# EAGLE board h11-5 (EAGLE 6.6.0)
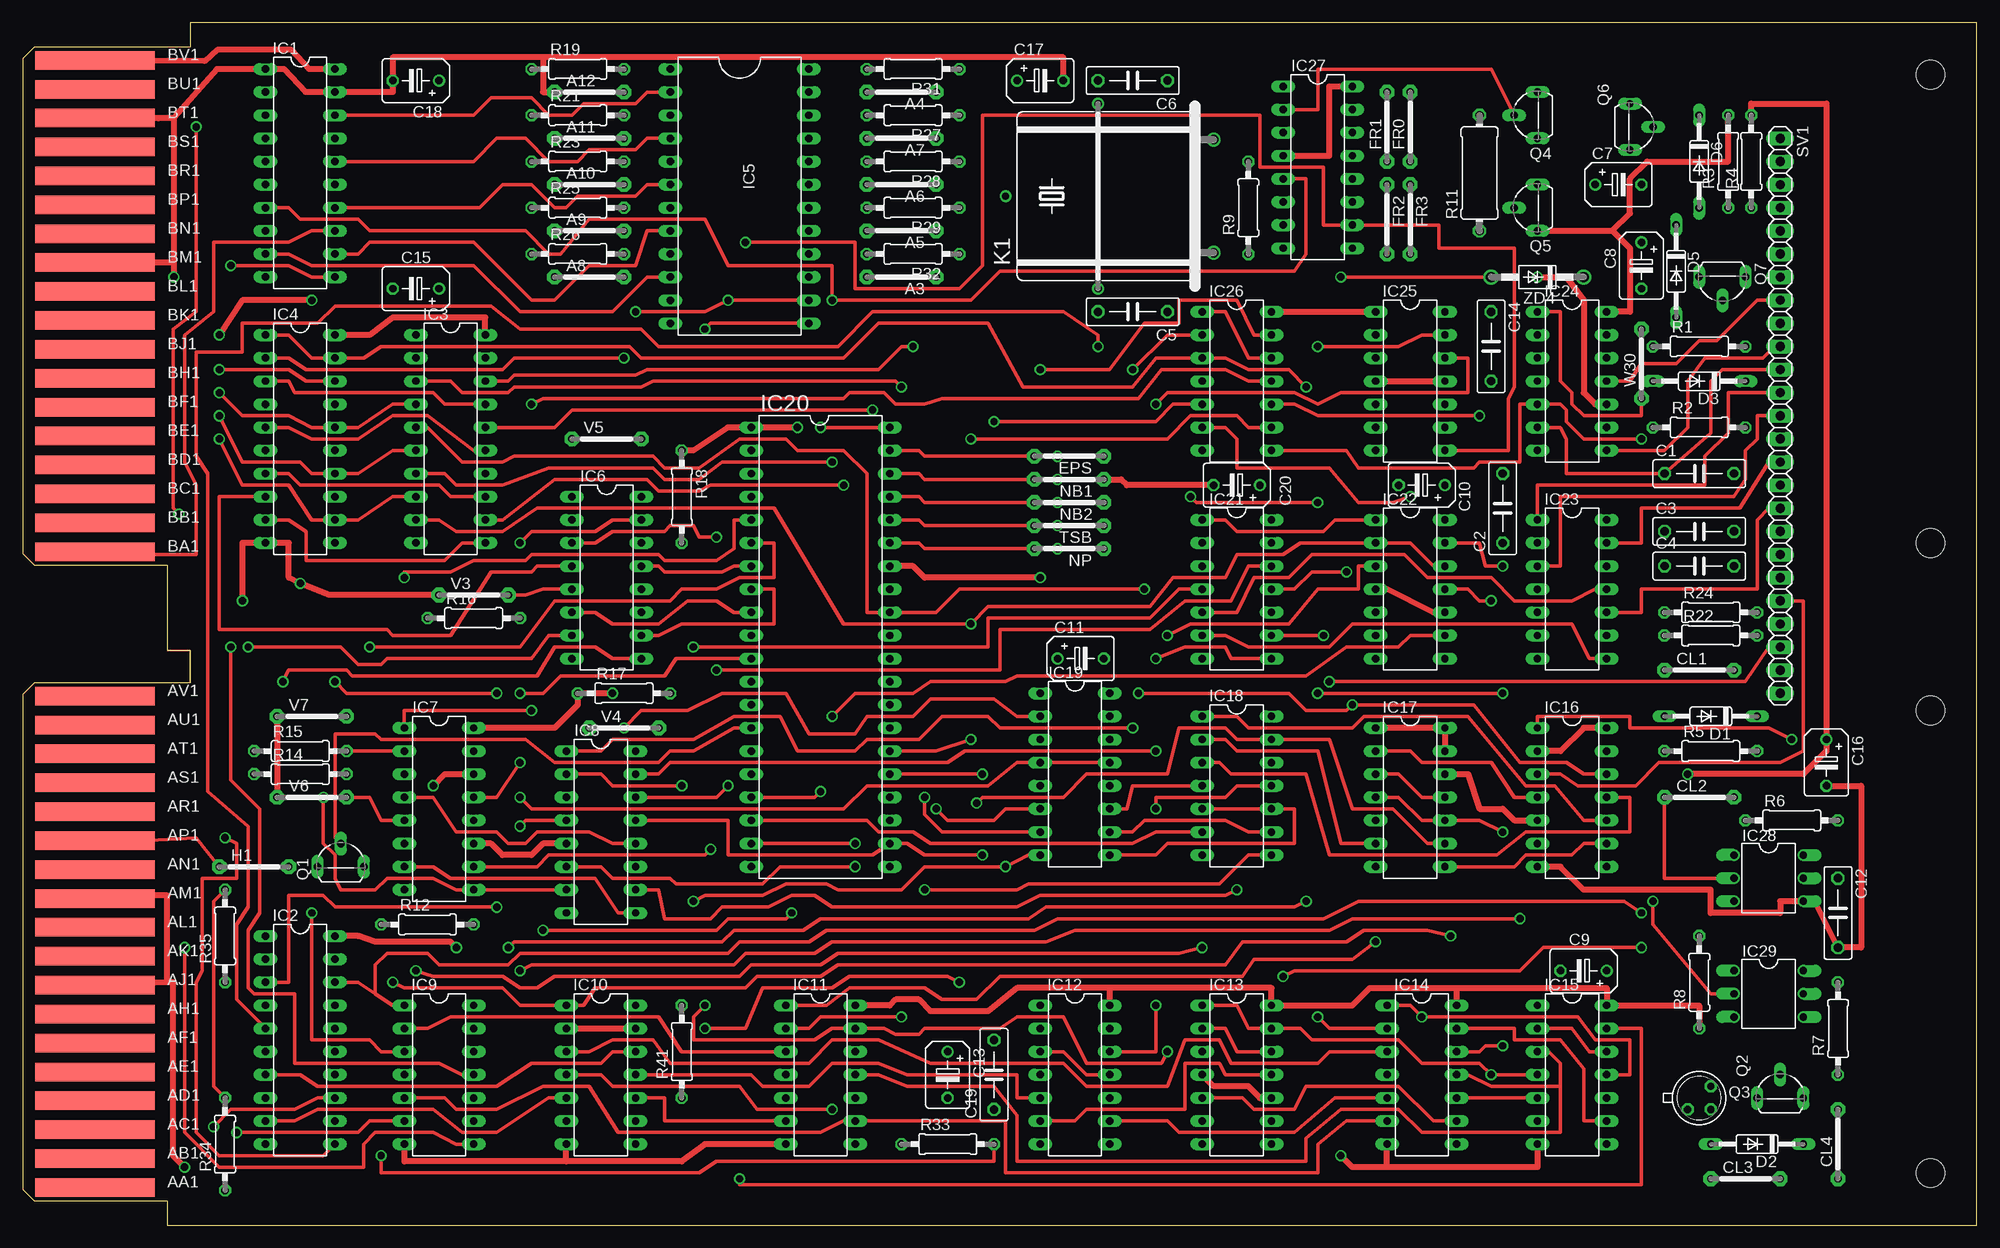
[diagram p2: board, top side]
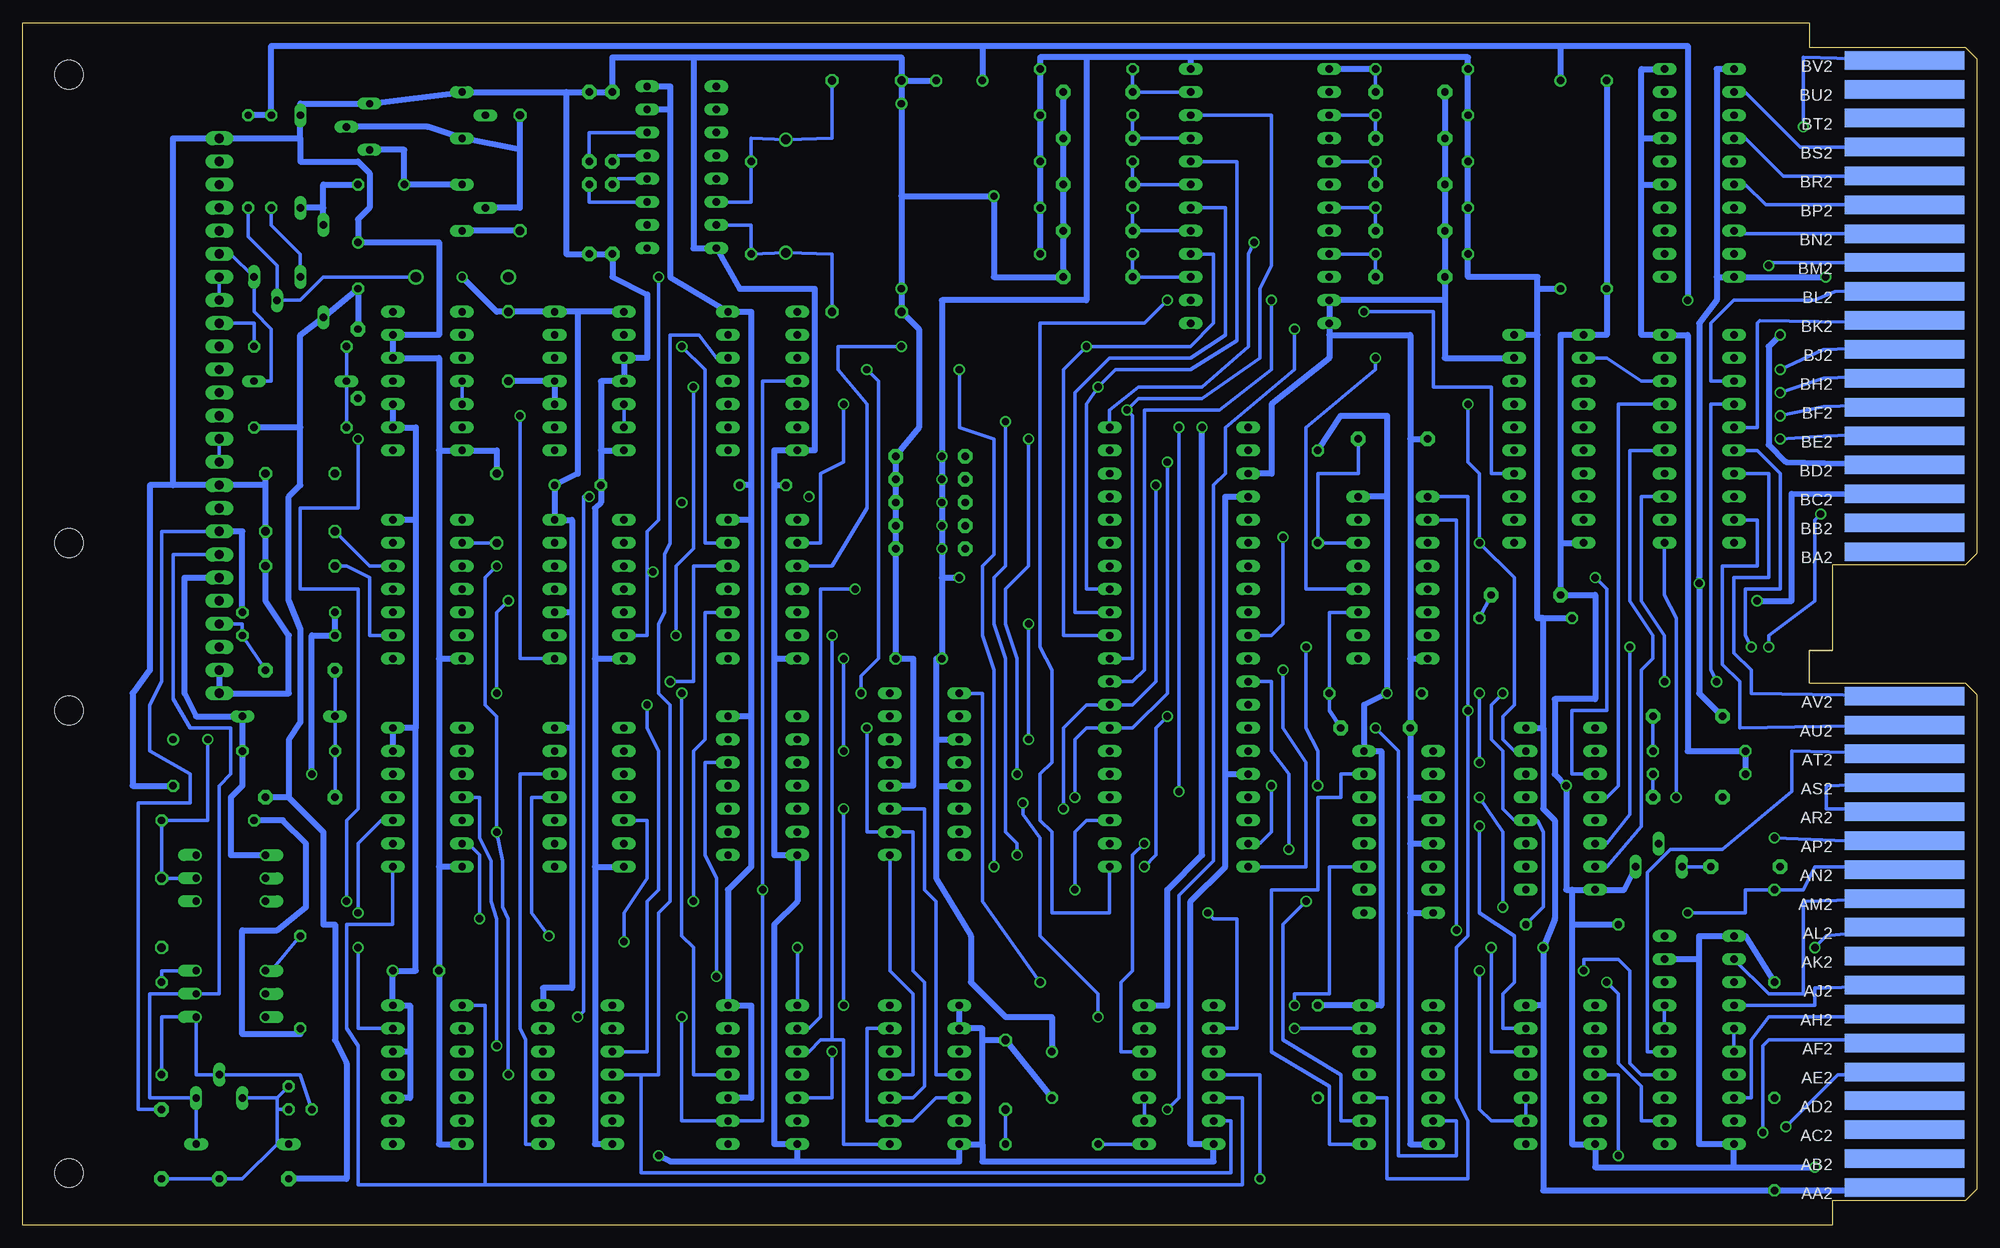
[diagram p3: board, bottom side, seen from below]

Size 214.63 x 132.08 mm. Coordinates in mm from the lower left corner, seen from the top.
Copper layers (1+16): Top 0.035mm / dielectric 1.5mm / Bottom 0.035mm
Design rules "16mils": minimum track width 16mil, minimum drill 32mil, track to track 15mil, track to pad 10mil, pad to pad 10mil, via to via 10mil, smd to smd 10mil, copper to edge 13mil, drill to drill 10mil, minimum pad ring 10mil, minimum via ring 8mil, stop-mask expansion 0mil, vias tented up to drill 0mil, thermal gap 10mil
Net classes: 1 Supply: width 0.635 mm

## Footprints (pad centres in the part's own frame; a part is rotated, then mirrored left to right if it is on the bottom)
07 = drill 0.813 pad 1.6 octagon: 1 -3.81,0; 2 3.81,0
C075-032X103 = drill 0.914 octagon: 1 -3.81,0; 2 3.81,0
B45181B = drill 0.813: + -2.54,0 | drill 0.813 octagon: - 2.54,0
DO35-10 = drill 0.813 long: A 5.08,0; C -5.08,0
DOUBLE-LONG = hole 3.175: 209.55,56.515; 209.55,5.715; 209.55,74.93; 209.55,126.365
EDGE-CON4 = smd 13.106 x 2.032: AA1 7.938,4.128; AB1 7.938,7.303; AC1 7.938,10.477; AD1 7.938,13.652; AE1 7.938,16.828; AF1 7.938,20.003; AH1 7.938,23.177; AJ1 7.938,26.352; AK1 7.938,29.527; AL1 7.938,32.703; AM1 7.938,35.877; AN1 7.938,39.053; AP1 7.938,42.227; AR1 7.938,45.403; AS1 7.938,48.578; AT1 7.938,51.752; AU1 7.938,54.928; AV1 7.938,58.102; BA1 7.938,73.978; BB1 7.938,77.153; BC1 7.938,80.328; BD1 7.938,83.502; BE1 7.938,86.677; BF1 7.938,89.853; BH1 7.938,93.028; BJ1 7.938,96.203; BK1 7.938,99.377; BL1 7.938,102.552; BM1 7.938,105.728; BN1 7.938,108.903; BP1 7.938,112.078; BR1 7.938,115.252; BS1 7.938,118.427; BT1 7.938,121.603; BU1 7.938,124.778; BV1 7.938,127.953 | smd 13.106 x 2.032 bottom: AA2 7.938,4.128; AB2 7.938,7.303; AC2 7.938,10.477; AD2 7.938,13.652; AE2 7.938,16.828; AF2 7.938,20.003; AH2 7.938,23.177; AJ2 7.938,26.352; AK2 7.938,29.527; AL2 7.938,32.703; AM2 7.938,35.877; AN2 7.938,39.053; AP2 7.938,42.227; AR2 7.938,45.403; AS2 7.938,48.578; AT2 7.938,51.752; AU2 7.938,54.928; AV2 7.938,58.102; BA2 7.938,73.978; BB2 7.938,77.153; BC2 7.938,80.328; BD2 7.938,83.502; BE2 7.938,86.677; BF2 7.938,89.853; BH2 7.938,93.028; BJ2 7.938,96.203; BK2 7.938,99.377; BL2 7.938,102.552; BM2 7.938,105.728; BN2 7.938,108.903; BP2 7.938,112.078; BR2 7.938,115.252; BS2 7.938,118.427; BT2 7.938,121.603; BU2 7.938,124.778; BV2 7.938,127.953
DIL20 = drill 0.813 long: 1 -11.43,-3.81; 2 -8.89,-3.81; 3 -6.35,-3.81; 4 -3.81,-3.81; 5 -1.27,-3.81; 6 1.27,-3.81; 7 3.81,-3.81; 8 6.35,-3.81; 9 8.89,-3.81; 10 11.43,-3.81; 11 11.43,3.81; 12 8.89,3.81; 13 6.35,3.81; 14 3.81,3.81; 15 1.27,3.81; 16 -1.27,3.81; 17 -3.81,3.81; 18 -6.35,3.81; 19 -8.89,3.81; 20 -11.43,3.81
DIL24 = drill 0.813 long: 1 -12.7,-7.62; 2 -10.16,-7.62; 3 -7.62,-7.62; 4 -5.08,-7.62; 5 -2.54,-7.62; 6 0,-7.62; 7 2.54,-7.62; 8 5.08,-7.62; 9 7.62,-7.62; 10 10.16,-7.62; 11 12.7,-7.62; 12 15.24,-7.62; 13 15.24,7.62; 14 12.7,7.62; 15 10.16,7.62; 16 7.62,7.62; 17 5.08,7.62; 18 2.54,7.62; 19 0,7.62; 20 -2.54,7.62; 21 -5.08,7.62; 22 -7.62,7.62; 23 -10.16,7.62; 24 -12.7,7.62
DIL16 = drill 0.813 long: 1 -8.89,-3.81; 2 -6.35,-3.81; 3 -3.81,-3.81; 4 -1.27,-3.81; 5 1.27,-3.81; 6 3.81,-3.81; 7 6.35,-3.81; 8 8.89,-3.81; 9 8.89,3.81; 10 6.35,3.81; 11 3.81,3.81; 12 1.27,3.81; 13 -1.27,3.81; 14 -3.81,3.81; 15 -6.35,3.81; 16 -8.89,3.81
DIL14 = drill 0.813 long: 1 -7.62,-3.81; 2 -5.08,-3.81; 3 -2.54,-3.81; 4 0,-3.81; 5 2.54,-3.81; 6 5.08,-3.81; 7 7.62,-3.81; 8 7.62,3.81; 9 5.08,3.81; 10 2.54,3.81; 11 0,3.81; 12 -2.54,3.81; 13 -5.08,3.81; 14 -7.62,3.81
DIL40 = drill 0.813 long: 1 -24.13,-7.62; 2 -21.59,-7.62; 3 -19.05,-7.62; 4 -16.51,-7.62; 5 -13.97,-7.62; 6 -11.43,-7.62; 7 -8.89,-7.62; 8 -6.35,-7.62; 9 -3.81,-7.62; 10 -1.27,-7.62; 11 1.27,-7.62; 12 3.81,-7.62; 13 6.35,-7.62; 14 8.89,-7.62; 15 11.43,-7.62; 16 13.97,-7.62; 17 16.51,-7.62; 18 19.05,-7.62; 19 21.59,-7.62; 20 24.13,-7.62; 21 24.13,7.62; 22 21.59,7.62; 23 19.05,7.62; 24 16.51,7.62; 25 13.97,7.62; 26 11.43,7.62; 27 8.89,7.62; 28 6.35,7.62; 29 3.81,7.62; 30 1.27,7.62; 31 -1.27,7.62; 32 -3.81,7.62; 33 -6.35,7.62; 34 -8.89,7.62; 35 -11.43,7.62; 36 -13.97,7.62; 37 -16.51,7.62; 38 -19.05,7.62; 39 -21.59,7.62; 40 -24.13,7.62
DIL06 = drill 0.813 offset: 1 -2.54,-3.81; 2 0,-3.81; 3 2.54,-3.81; 4 2.54,3.81; 5 0,3.81; 6 -2.54,3.81
HC33U-H = drill 1.016: 1 -6.223,-5.08; 2 6.223,-5.08 | drill 0.813: M -10.16,7.62; M1 10.16,7.62
TO92L = drill 0.813 long: 1 0,-2.54; 2 2.54,0; 3 0,2.54
TO18E = drill 0.813 octagon: D 1.27,-1.27; G 1.27,1.27; S -1.27,-1.27
0207/10 = drill 0.813 octagon: 1 -5.08,0; 2 5.08,0
0411/12 = drill 0.914 octagon: 1 -6.35,0; 2 6.35,0
1X25 = drill 1.016 long: 1 -29.21,0; 2 -26.67,0; 3 -24.13,0; 4 -21.59,0; 5 -19.05,0; 6 -16.51,0; 7 -13.97,0; 8 -11.43,0; 9 -8.89,0; 10 -6.35,0; 11 -3.81,0; 12 -1.27,0; 13 1.27,0; 14 3.81,0; 15 6.35,0; 16 8.89,0; 17 11.43,0; 18 13.97,0; 19 16.51,0; 20 19.05,0; 21 21.59,0; 22 24.13,0; 23 26.67,0; 24 29.21,0; 25 31.75,0
DO41Z10 = drill 1.118: A 5.08,0; C -5.08,0

## Placement (x,y rotation side)
A3  J7MM  [07]  96.52,104.14 180 top
A4  J7MM  [07]  96.52,124.46 180 top
A5  J7MM  [07]  96.52,109.22 180 top
A6  J7MM  [07]  96.52,114.3 180 top
A7  J7MM  [07]  96.52,119.38 180 top
A8  J7MM  [07]  62.23,104.14 0 top
A9  J7MM  [07]  62.23,109.22 0 top
A10  J7MM  [07]  62.23,114.3 0 top
A11  J7MM  [07]  62.23,119.38 0 top
A12  J7MM  [07]  62.23,124.46 0 top
C1  [C075-032X103]  184.15,82.55 0 top
C2  [C075-032X103]  162.56,78.74 90 top
C3  [C075-032X103]  184.15,76.2 0 top
C4  [C075-032X103]  184.15,72.39 0 top
C5  [C075-032X103]  121.92,100.33 180 top
C6  [C075-032X103]  121.92,125.73 180 top
C7  [B45181B]  175.26,114.3 0 top
C8  [B45181B]  177.8,105.41 270 top
C9  [B45181B]  171.45,27.94 180 top
C10  [B45181B]  153.67,81.28 180 top
C11  [B45181B]  116.21,62.23 0 top
C12  [C075-032X103]  199.39,34.29 270 top
C13  [B45181B]  101.6,16.51 270 top
C14  [C075-032X103]  161.29,96.52 270 top
C15  [B45181B]  43.18,102.87 180 top
C16  [B45181B]  198.12,50.8 270 top
C17  [B45181B]  111.76,125.73 0 top
C18  [B45181B]  43.18,125.73 180 top
C19  [C075-032X103]  106.68,16.51 90 top
C20  [B45181B]  133.35,81.28 180 top
CL1  [07]  184.15,60.96 0 top
CL2  [07]  184.15,46.99 0 top
CL3  [07]  189.23,5.08 0 top
CL4  [07]  199.39,8.89 90 top
D1  1N4149  [DO35-10]  185.42,55.88 180 top
D2  1N4149  [DO35-10]  190.5,8.89 180 top
D3  1N4149  [DO35-10]  184.15,92.71 180 top
D5  1N4149  [DO35-10]  181.61,104.78 270 top
D6  1N4149  [DO35-10]  184.15,116.84 270 top
E$2  [DOUBLE-LONG]  0,0 0 top
EDGE$  [EDGE-CON4]  0,0 0 top
EPS  [07]  114.94,84.45 180 top
FR0  [07]  152.4,120.65 90 top
FR1  [07]  149.86,120.65 90 top
FR2  [07]  149.86,110.49 270 top
FR3  [07]  152.4,110.49 270 top
H1  J7MM  [07]  25.4,39.37 0 top
IC1  74LS240N  [DIL20]  30.48,115.57 270 top
IC2  74LS240N  [DIL20]  30.48,20.32 270 top
IC3  74LS240N  [DIL20]  46.99,86.36 270 top
IC4  74S240N  [DIL20]  30.48,86.36 270 top
IC5  8130  [DIL24]  78.74,114.3 270 top
IC6  74LS157N  [DIL16]  64.14,71.12 270 top
IC7  74LS257N  [DIL16]  45.72,45.72 270 top
IC8  74LS257N  [DIL16]  63.5,43.18 270 top
IC9  7438N  [DIL14]  45.72,16.51 270 top
IC10  74LS00N  [DIL14]  63.5,16.51 270 top
IC11  74LS08N  [DIL14]  87.63,16.51 270 top
IC12  74LS27N  [DIL14]  115.57,16.51 270 top
IC13  74LS74N  [DIL14]  133.35,16.51 270 top
IC14  74LS10N  [DIL14]  153.67,16.51 270 top
IC15  74LS74N  [DIL14]  170.18,16.51 270 top
IC16  74LS00N  [DIL14]  170.18,46.99 270 top
IC17  74LS74N  [DIL14]  152.4,46.99 270 top
IC18  74LS10N  [DIL14]  133.35,48.26 270 top
IC19  74LS75N  [DIL16]  115.57,49.53 270 top
IC20  6402  [DIL40]  87.63,63.5 270 top
IC21  74LS02N  [DIL14]  133.35,69.85 270 top
IC22  74LS74N  [DIL14]  152.4,69.85 270 top
IC23  1489N  [DIL14]  170.18,69.85 270 top
IC24  1488N  [DIL14]  170.18,92.71 270 top
IC25  74LS196  [DIL14]  152.4,92.71 270 top
IC26  74LS08N  [DIL14]  133.35,92.71 270 top
IC27  4702  [DIL16]  142.24,116.2 270 top
IC28  4N26  [DIL06]  191.77,38.1 270 top
IC29  4N26  [DIL06]  191.77,25.4 270 top
K1  2.4576Mhz  [HC33U-H]  125.73,113.03 90 top
NB1  [07]  114.94,81.92 180 top
NB2  [07]  114.94,79.38 180 top
NP  [07]  114.94,74.3 180 top
Q1  MPSA06  [TO92L]  34.93,39.37 90 top
Q2  MPSA55  [TO92L]  193.04,13.97 90 top
Q3  NCh, 30V, 1.5mA  [TO18E]  184.15,13.97 0 top
Q4  MPSA06  [TO92L]  166.37,121.92 180 top
Q5  MPSA06  [TO92L]  166.37,111.76 180 top
Q6  MPSA55  [TO92L]  176.53,120.65 0 top
Q7  MPSA55  [TO92L]  186.69,104.14 270 top
R1  [0207/10]  184.15,96.52 0 top
R2  [0207/10]  184.15,87.63 0 top
R3  [0207/10]  187.33,116.84 90 top
R4  [0207/10]  189.87,116.84 90 top
R5  [0207/10]  185.42,52.07 0 top
R6  [0207/10]  194.31,44.45 0 top
R7  [0207/10]  199.39,21.59 90 top
R8  [0207/10]  184.15,26.67 90 top
R9  [0207/10]  134.62,111.76 90 top
R11  [0411/12]  160.02,115.57 90 top
R12  [0207/10]  44.45,33.02 0 top
R14  [0207/10]  30.48,49.53 0 top
R15  [0207/10]  30.48,52.07 0 top
R16  [0207/10]  49.53,66.67 0 top
R17  [0207/10]  66.04,58.42 0 top
R18  [0207/10]  72.39,80.01 270 top
R19  [0207/10]  60.96,127 0 top
R21  [0207/10]  60.96,121.92 0 top
R22  [0207/10]  185.42,64.77 0 top
R23  [0207/10]  60.96,116.84 0 top
R24  [0207/10]  185.42,67.31 0 top
R25  [0207/10]  60.96,111.76 0 top
R26  [0207/10]  60.96,106.68 0 top
R27  [0207/10]  97.79,121.92 180 top
R28  [0207/10]  97.79,116.84 180 top
R29  [0207/10]  97.79,111.76 180 top
R31  [0207/10]  97.79,127 180 top
R32  [0207/10]  97.79,106.68 180 top
R33  [0207/10]  101.6,8.89 0 top
R34  [0207/10]  22.23,8.89 90 top
R35  [0207/10]  22.23,31.75 90 top
R41  [0207/10]  72.39,19.05 90 top
SV1  [1X25]  193.04,90.17 270 top
TSB  [07]  114.94,76.83 180 top
V3  [07]  49.53,69.22 0 top
V4  [07]  66.04,54.61 0 top
V5  [07]  64.14,86.36 0 top
V6  [07]  31.75,46.99 0 top
V7  [07]  31.75,55.88 0 top
W30  [07]  177.8,94.61 90 top
ZD4  1N4738A  [DO41Z10]  166.37,104.14 180 top

## Tracks (layer width: path | path; a pad name or v marks a point on that pad's centre or on a via)
!A1R  (via drill 0.81)
  Top 0.406: v73.66,35.56 74.93,36.2 81.28,36.2 83.82,37.47 88.27,37.47 89.54,36.83 96.52,36.83 99.06,39.37 v107.95,39.37 110.49,40.64 IC19.8 | IC26.13 135.26,97.79 133.35,101.6 127,101.6 127,99.06 123.19,99.06 119.38,93.98 113.03,93.98 | v111.76,93.98 113.03,93.98 | 113.03,93.98 114.3,93.98
  Bottom 0.406: IC10.9 69.85,11.43 69.85,16.51 76.2,20.32 76.2,24.13 76.2,33.02 v73.66,35.56 | v107.95,39.37 107.95,60.96 109.22,64.77 109.22,72.39 107.95,73.66 107.95,86.36 111.76,87.63 v111.76,93.98
!A2R
  Top 0.406: IC19.11 121.29,45.72 121.92,48.26 IC18.4
  Bottom 0.406: IC19.11 115.57,45.72 115.57,36.83 114.3,35.56 114.3,16.51 113.03,16.51 | 113.03,16.51 112.4,16.51 | IC12.4 113.03,16.51
!BBS7  (via drill 0.81)
  Top 0.406: IC2.11 33.02,7.62 21.59,7.62 19.05,10.16 19.05,26.67 19.69,27.94 19.69,38.1 23.5,38.1 23.5,41.91 v22.23,42.55
  Bottom 0.406: EDGE$.AP2 7.62,41.91 v22.23,42.55
!BDAL0
  Top 0.406: IC3.11 48.26,74.93 46.36,73.03 31.12,73.03 31.12,76.2 29.21,77.47 IC4.9
  Bottom 0.406: EDGE$.AU2 26.04,54.61 26.04,59.69 27.94,61.59 27.94,72.39 24.13,72.39 24.13,77.47 IC4.9
!BDAL1
  Top 0.406: IC3.13 46.99,80.01 45.72,81.28 30.48,81.28 29.21,82.55 IC4.7
  Bottom 0.406: EDGE$.AV2 24.77,58.42 24.77,60.96 26.67,62.87 26.67,71.12 22.86,71.12 22.86,82.55 IC4.7
!BDAL2  (via drill 0.81)
  Top 0.406: v21.59,86.36 24.13,81.28 29.21,81.28 31.75,77.47 IC4.12 36.83,77.47 40.64,80.01 IC3.8
  Bottom 0.406: v21.59,86.36 16.82,86.69 7.62,87 EDGE$.BE2
!BDAL3  (via drill 0.81)
  Top 0.406: v21.59,88.9 24.13,83.82 30.48,83.82 31.75,82.55 IC4.14 36.83,82.55 40.64,85.09 IC3.6
  Bottom 0.406: v21.59,88.9 16.79,89.89 7.62,90.17 EDGE$.BF2
!BDAL4  (via drill 0.81)
  Top 0.406: v21.59,91.44 24.13,88.9 29.21,88.9 31.75,87.63 IC4.16 36.83,87.63 40.64,90.17 IC3.4
  Bottom 0.406: v21.59,91.44 16.82,93.04 7.62,93.34 EDGE$.BH2
!BDAL5  (via drill 0.81)
  Top 0.406: v21.59,93.98 29.21,93.98 31.12,92.71 IC4.18
  Bottom 0.406: v21.59,93.98 16.84,96.19 7.62,96.52 EDGE$.BJ2 | IC4.18 36.83,92.71 40.64,95.25 IC3.2
!BDAL6
  Top 0.406: IC3.15 49.53,85.09 44.45,88.9 40.64,88.9 36.83,86.36 31.75,86.36 29.21,87.63 IC4.5
  Bottom 0.406: IC4.5 24.13,87.63 24.13,99.06 23.83,99.36 7.62,99.06 EDGE$.BK2
!BDAL7
  Top 0.406: IC3.17 46.36,90.17 45.09,91.44 29.85,91.44 29.21,92.71 IC4.3
  Bottom 0.406: IC4.3 29.21,92.71 29.21,99.06 26.67,101.6 17.78,101.6 15.57,102.54 7.62,102.87 EDGE$.BL2
!BDAL8  (via drill 0.81)
  Top 0.406: v22.86,105.41 29.21,105.41 31.75,104.14 IC1.11
  Bottom 0.406: EDGE$.BM2 22.53,105.74 v22.86,105.41
!BDAL9
  Bottom 0.406: EDGE$.BN2 26.34,108.89 IC1.8
!BDAL10
  Bottom 0.406: EDGE$.BP2 23.19,112.09 25.4,114.3 IC1.6
!BDAL11
  Bottom 0.406: EDGE$.BR2 21.26,115.24 25.4,119.38 IC1.4
!BDAL12
  Bottom 0.406: EDGE$.BS2 19.36,118.42 25.4,124.46 IC1.2
!BDAL15  (via drill 0.81)
  Top 0.406: v19.05,120.65 19.05,100.33 16.51,98.42 16.51,78.74 v17.15,78.11 | IC9.11 48.26,16.51 45.72,17.78 29.85,17.78 29.85,25.4 25.4,25.4 24.77,26.04 24.77,32.38 26.04,34.29 26.04,45.72 22.86,48.9 v22.86,63.5
  Bottom 0.406: v22.86,63.5 22.86,64.77 17.78,68.58 17.78,77.47 v17.15,78.11 | EDGE$.BV2 19.05,128.27 v19.05,120.65
!BDIN
  Bottom 0.406: IC2.8 24.77,13.97 24.77,20.32 22.86,22.86 7.62,22.86 EDGE$.AH2
!BDOUT  (via drill 0.81)
  Top 0.406: IC2.13 32.39,13.97 29.85,12.7 22.86,12.7 v20.96,10.79
  Bottom 0.406: v20.96,10.79 15.24,16.51 7.62,16.51 EDGE$.AE2
!BHALT
  Top 0.406: H1.1 19.05,42.55 7.62,41.91
  Top 0.635: EDGE$.AP1 7.62,42.19 7.62,41.91
!BIAKI
  Bottom 0.406: EDGE$.AM2 19.05,35.56 19.05,25.4 22.86,25.4 IC2.2
!BIAKO  (via drill 0.81)
  Top 0.406: IC9.3 39.37,19.05 38.1,20.32 31.75,20.32 v31.75,34.29 | R34.2 20.96,15.24 20.96,35.56 R35.2
  Bottom 0.406: v31.75,34.29 25.4,34.29 25.4,36.83 R35.2 19.05,36.83 17.78,39.37 7.62,39.37 EDGE$.AN2
!BINIT
  Bottom 0.406: EDGE$.AT2 20.32,52.07 20.32,47.62 27.94,41.27 33.66,41.27 36.2,38.73 36.2,19.05 IC2.15
!BIRQ4  (via drill 0.81)
  Top 0.406: IC9.8 47.63,8.89 45.09,10.16 38.74,10.16 37.47,8.89 37.47,6.35 21.59,6.35 17.78,10.16 v17.78,30.48
  Bottom 0.406: EDGE$.AL2 16.51,31.75 v17.78,30.48
!BRPLY  (via drill 0.81)
  Top 0.406: IC9.6 38.1,11.43 36.83,10.16 v23.5,10.16
  Bottom 0.406: v23.5,10.16 23.5,19.68 22.86,20.32 7.62,20.32 EDGE$.AF2
!BSYNC
  Bottom 0.406: EDGE$.AJ2 16.51,26.04 17.78,26.04 17.78,24.13 IC2.4
!BUF  (via drill 0.81)
  Top 0.406: IC8.15 69.85,49.53 71.12,50.8 101.6,50.8 103.51,52.07 v124.46,52.07 | IC21.8 132.72,62.23 132.08,63.5 127.64,63.5 v124.46,62.23
  Bottom 0.406: v124.46,52.07 v124.46,62.23 | IC8.15 69.85,49.53 69.85,46.99 72.39,46.99 72.39,36.83 77.47,36.83 77.47,19.05 71.12,15.24 71.12,8.89 IC10.8
!CTS
  Top 0.406: IC23.11 172.72,69.85 170.18,68.58 163.83,68.58 161.29,71.12 154.31,71.12 151.77,73.66 141.61,73.66 139.07,71.12 135.26,71.12 133.35,67.31 IC21.5
!DIN  (via drill 0.81)
  Top 0.406: IC4.1 29.21,97.79 31.75,95.25 IC4.19 37.47,95.25 39.37,96.52 66.68,96.52 67.95,95.25 90.17,95.25 93.98,99.06 106.05,99.06 109.86,92.08 114.94,92.08 | v140.97,92.08 139.07,93.98 134.62,93.98 132.08,95.25 IC26.3 124.46,95.25 121.92,92.08 114.94,92.08 | 114.94,92.08 114.3,92.08 | v142.88,64.77 IC21.9
  Bottom 0.406: v142.88,64.77 142.88,72.39 140.97,74.3 v140.97,92.08
!DSR
  Top 0.406: IC23.8 172.09,62.23 170.18,66.04 146.05,66.04 143.51,63.5 134.62,63.5 132.08,64.77 IC21.6
!IIAKI  (via drill 0.81)
  Top 0.406: IC15.13 177.8,21.59 177.8,4.45 78.74,4.45 v78.74,5.08 | v177.8,30.48 167.01,30.48 164.47,27.94 139.7,27.94 v138.43,27.3
  Bottom 0.406: v78.74,5.08 78.74,16.51 IC11.4 | IC15.13 177.8,21.59 v177.8,30.48 | IC18.12 139.7,50.8 139.7,40.64 138.43,38.1 v138.43,27.3
!INIT  (via drill 0.81)
  Top 0.406: v43.18,27.94 45.09,27.3 52.71,27.3 54.61,26.04 56.52,26.04 58.42,27.3 78.74,27.3 80.01,28.57 87.63,28.57 89.54,29.84 127,29.84 v129.54,30.48 | IC15.4 v161.29,16.51 160.02,17.78 153.67,17.78 151.13,20.32 141.61,20.32 140.34,21.59 IC13.13 134.62,21.59 133.35,24.13 IC13.1 | IC17.4 151.13,46.99 153.67,44.45 IC17.10 160.02,44.45 v162.56,43.18 | IC22.13 160.02,74.93 160.66,72.39 v162.56,72.39
  Bottom 0.406: v43.18,27.94 43.18,29.21 39.37,29.21 38.1,27.94 38.1,17.78 36.83,16.51 IC2.14 | v162.56,72.39 163.83,71.12 163.83,57.15 162.56,55.88 v162.56,43.18 161.93,40.01 161.93,34.92 161.29,33.66 v161.29,16.51 | v129.54,30.48 IC13.1
!MDIN  (via drill 0.81)
  Top 0.406: v121.92,93.98 125.73,97.79 IC26.2 | IC10.3 62.23,19.05 64.77,20.32 69.22,20.32 71.12,17.78 86.36,17.78 88.9,20.32 93.98,20.32 99.7,17.78 114.3,17.78 116.84,15.24 125.73,15.24 127.64,20.32 131.45,20.32 132.72,17.78 142.24,17.78 143.51,19.05 IC14.3 | IC16.12 171.45,49.53 169.55,50.8 164.47,50.8 159.39,57.15 v146.05,57.15 145.42,56.52 140.97,56.52 139.07,58.42 v122.56,58.42
  Bottom 0.406: v121.92,93.98 120.65,92.71 120.65,62.23 122.56,60.33 v122.56,58.42 | v146.05,57.15 146.05,54.61 144.78,52.07 144.78,36.83 146.05,35.56 146.05,19.05 IC14.3
!MDOUT
  Top 0.406: IC14.5 144.15,13.97 139.7,10.16 127,10.16 125.73,11.43 IC12.9 | IC12.5 109.22,13.97 109.22,16.51 97.16,16.51 93.98,17.78 88.9,17.78 86.36,15.24 81.28,15.24 80.01,16.51 IC10.11
  Bottom 0.406: 113.03,13.97 112.4,13.97 | 113.03,13.97 114.3,13.97 116.84,11.43 IC12.9 121.92,11.43 121.92,21.59 120.65,21.59 | 120.65,21.59 120.02,21.59 | IC12.5 113.03,13.97 | 120.65,21.59 IC12.13
!MIRDY
  Top 0.635: IC17.12 158.75,49.53 160.02,45.72 162.56,45.72 163.83,44.45 IC16.5
  Bottom 0.406: IC17.12 160.02,49.53 160.02,21.59 159.39,20.32 159.39,8.89 IC14.8
!MXRDY  (via drill 0.81)
  Top 0.406: IC16.4 163.83,46.99 161.29,50.8 153.67,50.8 152.4,52.07 IC17.2 | IC14.12 160.02,19.05 160.66,19.68 v162.56,19.68
  Bottom 0.406: IC16.4 164.47,46.99 164.47,42.55 163.2,40.01 163.2,35.56 162.56,33.66 v162.56,19.68
!MYIO  (via drill 0.81)
  Top 0.406: IC19.2 109.22,55.88 106.68,57.78 99.7,57.78 97.79,55.88 92.71,55.88 91.44,53.98 86.36,53.98 83.82,58.42 76.84,58.42 73.03,56.52 67.95,56.52 v66.04,54.61
  Bottom 0.406: v66.04,54.61 63.5,52.07 63.5,7.62 57.15,7.62 57.15,11.43 IC10.6
!NOEOT  (via drill 0.81)
  Top 0.406: IC25.13 153.67,97.79 151.13,96.52 v142.24,96.52
  Bottom 0.406: v142.24,96.52 139.7,93.98 139.7,74.93 IC21.13
!RBUF
  Top 0.406: IC18.6 124.46,43.18 121.92,41.91 99.7,41.91 97.79,43.18 93.98,43.18 92.71,44.45 IC20.18
!RIRQ  (via drill 0.81)
  Top 0.406: v148.59,31.11 146.05,29.21 135.26,29.21 133.99,27.3 107.32,27.3 104.78,24.77 100.97,24.77 99.06,26.04 90.81,26.04 88.27,24.13 IC11.1
  Bottom 0.406: IC17.5 146.05,44.45 146.05,38.1 148.59,34.29 v148.59,31.11
!RRUN  (via drill 0.81)
  Top 0.406: ZD4.A v144.78,104.14 | IC21.11 139.7,69.85 141.61,71.75 v145.42,71.75
  Bottom 0.406: v144.78,104.14 144.78,77.47 146.05,76.2 146.05,71.75 | 146.05,71.75 146.05,64.77 | 146.05,64.77 147.32,64.77 | 146.05,71.75 v145.42,71.75 | 146.05,64.77 IC22.6
!RSTOP
  Top 0.406: IC22.1 144.15,77.47 142.88,76.2 133.35,76.2 132.08,77.47 IC21.1
!RXEIA
  Top 0.406: IC23.1 166.37,81.28 184.79,81.28 184.79,84.45 187.33,87 187.33,91.44 SV1.12
!SBRK  (via drill 0.81)
  Top 0.406: IC26.10 139.7,90.17 142.24,88.9 v160.02,88.9
  Bottom 0.406: v160.02,88.9 160.02,62.23 IC22.8
!SYNC  (via drill 0.81)
  Top 0.406: IC2.3 29.21,26.67 29.21,36.2 33.02,36.2 34.29,34.92 v52.07,34.92 | IC19.13 IC19.4 109.22,50.8 106.05,48.26 92.71,48.26 90.17,45.72 55.88,45.72 v54.61,46.99
  Bottom 0.406: v54.61,46.99 52.07,43.18 v52.07,34.92
!TXEIA
  Top 0.406: SV1.11 186.69,93.98 185.42,92.71 185.42,87 C1.1 169.55,82.55 169.55,86.36 168.91,87.63 IC24.6
!XBUF  (via drill 0.81)
  Top 0.406: IC18.8 134.62,40.64 131.45,37.47 110.49,37.47 109.22,36.83 v99.06,36.83
  Bottom 0.406: v99.06,36.83 99.06,43.18 97.79,44.45 IC20.23
!XIAKI
  Bottom 0.406: IC15.1 163.83,24.13 163.83,4.45 | 163.83,4.45 80.65,4.45 80.65,13.97 IC11.5 | 163.83,4.45 177.8,4.45 177.8,19.68 179.07,21.59 179.07,33.02 173.99,33.02 173.99,38.1 | 173.99,38.1 173.99,38.73 | 173.99,38.1 IC16.8
!XIRQ  (via drill 0.81)
  Top 0.406: IC11.2 86.36,21.59 87.63,22.86 v96.52,22.86 | v104.78,46.35 105.41,46.99 114.3,46.99 116.84,49.53 125.73,49.53 127,54.61 132.08,54.61 133.35,53.34 IC18.13 143.51,53.34 146.05,45.72 150.5,45.72 154.31,41.91 IC17.9 | v57.15,32.38 76.2,32.38 77.47,33.66 83.82,33.66 v84.46,34.29
  Bottom 0.406: IC11.2 81.28,21.59 81.28,33.66 83.82,33.66 v84.46,34.29 | IC6.2 57.15,77.47 v57.15,32.38 | v96.52,22.86 96.52,25.4 102.87,31.75 102.87,42.55 104.78,45.09 v104.78,46.35
+12V  (via drill 0.81)
  Top 0.635: v21.59,97.79 24.13,101.6 v31.75,101.6 | 174.63,109.22 176.53,107.31 176.53,100.33 IC24.14 | 174.63,109.22 176.53,111.12 176.53,114.94 178.44,116.84 187.33,116.84 R3.2 | Q5.3 174.63,109.22 | v182.88,49.53 195.58,49.53 198.12,52.07 C16.+ 198.12,123.19 189.87,123.19 R4.2
  Bottom 0.635: EDGE$.BD2 20.96,83.82 22.86,85.72 22.86,96.52 v21.59,97.79 | v31.75,101.6 31.75,129.54 45.72,129.54 | 109.22,129.54 187.33,129.54 R3.2 R4.2 | 109.22,129.54 45.72,129.54 | 45.72,129.54 C18.+ | R11.1 Q5.3 | 109.22,129.54 C17.+ | R24.1 R22.1 182.88,64.77 v182.88,49.53
-12V
  Bottom 0.635: W30.2 C8.- D5.A 184.15,97.79 184.15,87.63 | CL3.1 179.07,5.08 179.07,17.78 180.34,20.32 180.34,33.02 181.61,33.02 181.61,43.18 185.42,46.99 | 185.42,46.99 185.42,53.34 184.15,55.24 184.15,65.41 185.42,68.58 185.42,80.01 184.15,81.28 184.15,87.63 | 184.15,87.63 R2.2 | 185.42,46.99 CL2.2
-12V_EIA
  Top 0.406: W30.1 177.8,88.9 171.45,88.9 170.18,90.17 170.18,91.44 168.91,92.71 168.91,100.33 IC24.1
A1R
  Top 0.406: IC18.5 IC18.10 139.7,45.72 139.7,41.91 125.73,41.91 124.46,40.64 IC19.9 | IC12.3 114.3,19.05 116.84,16.51 IC12.11
  Bottom 0.406: IC12.11 116.84,16.51 116.84,25.4 119.38,27.94 IC19.9
A2R  (via drill 0.81)
  Top 0.406: IC18.9 134.62,43.18 132.08,44.45 123.19,44.45 121.92,43.18 IC19.10 | v121.92,54.61 107.32,54.61 106.05,55.88 100.97,55.88 98.43,53.34 92.71,53.34 91.44,52.07 85.09,52.07 83.19,55.88 78.11,55.88 73.66,53.34 64.77,53.34 63.5,52.07 IC8.1
  Bottom 0.406: v121.92,54.61 121.92,43.18 IC19.10 116.84,43.18 116.84,27.94 115.57,26.67 115.57,15.24 116.84,13.97 118.11,13.97 | 118.11,13.97 118.75,13.97 | 118.11,13.97 IC12.10
A3
  Bottom 0.406: IC5.15 A3.2 R32.2
A4
  Bottom 0.406: IC5.23 A4.2 R31.2
A5
  Bottom 0.406: R29.2 A5.2 IC5.17
A6
  Bottom 0.406: IC5.19 A6.2 R28.2
A7
  Bottom 0.406: IC5.21 A7.2 R27.2
A8
  Bottom 0.406: A8.2 R26.2 IC5.9
A9
  Bottom 0.406: IC5.7 R25.2 A9.2
A10
  Bottom 0.406: A10.2 R23.2 IC5.5
A11
  Bottom 0.406: A11.2 R21.2 IC5.3
A12
  Bottom 0.406: A12.2 R19.2
  Bottom 0.635: R19.2 IC5.1
AMTCH  (via drill 0.81)
  Top 0.406: IC5.13 75.57,99.06 v74.93,98.42 | v88.9,12.7 80.65,12.7 78.74,15.24 72.39,15.24 | 72.39,15.24 64.77,15.24 63.5,16.51 IC10.4 | 72.39,15.24 R41.1
  Bottom 0.406: v88.9,12.7 87.63,13.97 87.63,36.2 83.82,40.01 83.82,81.28 82.55,82.55 82.55,87.63 74.93,93.98 v74.93,98.42
BDCOK
  Top 0.406: IC1.13 31.75,109.22 29.21,107.95 20.96,107.95 20.96,100.33 17.78,97.79 17.78,83.82 19.05,81.28 19.05,73.66 7.62,73.66
  Top 0.635: EDGE$.BA1 7.62,73.66
BDMG
  Bottom 0.406: EDGE$.AS2 16.51,48.26 16.51,45.72 7.62,45.72 EDGE$.AR2
BRPLY
  Top 0.406: IC14.6 145.42,11.43 142.24,8.89 142.24,5.71 107.95,5.71 107.95,11.43 IC11.9 90.17,11.43 87.63,10.16 65.41,10.16 62.23,15.24 57.15,15.24 52.07,12.7 47.63,12.7 46.36,13.97 IC9.5
  Bottom 0.406: IC11.9 IC11.10
BUF  (via drill 0.81)
  Top 0.406: IC6.15 64.77,77.47 62.87,76.2 55.88,76.2 v54.61,74.93 | IC26.11 134.62,92.71 132.08,93.98 125.1,93.98 122.56,90.81 100.97,90.81 99.06,90.17 95.89,90.17 94.62,91.44 90.81,91.44 90.17,90.81 57.15,90.81 v55.88,90.17
  Bottom 0.406: IC7.15 50.8,52.07 52.07,53.34 52.07,55.88 50.8,57.15 50.8,71.12 v54.61,74.93 54.61,82.55 55.88,83.82 v55.88,90.17
BUFDIN  (via drill 0.81)
  Top 0.406: v53.34,30.48 53.98,31.11 76.84,31.11 78.11,32.38 85.73,32.38 87.63,33.66 110.49,33.66 112.4,34.92 139.7,34.92 v140.97,35.56
  Bottom 0.406: v53.34,30.48 53.34,19.05 IC9.12 | v140.97,35.56 140.97,52.07 139.7,53.34 139.7,67.31 IC21.10
BUSY
  Top 0.406: IC24.8 180.34,85.09 182.88,87.63 182.88,92.71 184.79,95.25 191.14,95.25 192.41,96.52 SV1.10
CLK0  (via drill 0.81)
  Top 0.406: IC20.17 87,46.99 v87.63,47.62 | IC20.40 v87.63,87.63 | v79.38,107.95 91.44,107.95 91.44,102.87 102.87,102.87 105.41,105.41 105.41,121.92 135.89,121.92 135.89,116.2 142.88,116.2 142.88,109.86 IC27.10 155.58,109.86 155.58,107.31 163.83,107.31 163.83,92.08 163.2,90.81 163.2,85.09 IC25.8
  Bottom 0.406: v87.63,87.63 v87.63,47.62 | v79.38,107.95 80.01,106.68 80.01,96.52 85.09,92.08 92.08,92.08 95.25,89.53 IC20.40
CTS
  Top 0.406: IC23.13 177.8,74.93 177.8,78.74 188.6,78.74 191.77,83.82 SV1.15
  Bottom 0.406: SV1.15 SV1.14
DR0  (via drill 0.81)
  Top 0.406: v91.44,41.91 IC20.19 | IC8.14 76.2,46.99 v77.47,48.26
  Bottom 0.406: v77.47,48.26 77.47,43.18 78.74,41.91 IC20.19 | IC11.12 93.98,19.05 93.98,26.67 92.71,27.94 92.71,40.64 v91.44,41.91
DSR  (via drill 0.81)
  Top 0.406: IC21.4 127,69.85 123.83,66.67 106.05,66.67 106.05,63.5 v73.66,63.5 | IC8.2 63.5,49.53 64.77,48.26 v72.39,48.26
  Bottom 0.406: v73.66,63.5 73.66,54.61 72.39,52.07 v72.39,48.26
DSREIA
  Top 0.406: IC23.10 177.8,67.31 177.8,69.85 190.5,69.85 190.5,77.47 191.77,78.74 SV1.17
EPS
  Top 0.406: IC20.39 98.43,85.09 99.06,84.45 EPS.2
FE0
  Top 0.406: IC20.14 78.11,54.61 73.66,52.07 71.12,52.07 69.85,50.8 58.42,50.8 55.25,53.34 39.37,53.34 38.74,53.98 34.29,53.98 34.29,42.55 Q1.2
GND  (via drill 0.81, 0.81 pad 1.27)
  Top 0.635: EDGE$.BT1 14.91,121.59 16.6,121.58 | 16.6,121.58 21.34,127 IC1.1 28.7,127 31.07,124.46 IC1.19 40.64,124.46 C18.- 40.64,128.27 57.15,128.27 | 16.6,121.58 16.6,105.74 | 16.6,105.74 EDGE$.BM1 | 16.6,105.74 v16.6,104.14 | v24.13,68.58 24.13,74.93 IC4.10 29.21,74.93 29.21,71.12 v30.48,70.48 33.66,69.22 V3.1 | 57.15,128.27 57.15,124.46 A12.1 | V7.1 V6.1 | 15.88,26.67 EDGE$.AJ1 | 15.88,26.67 15.88,36.2 7.62,36.2 EDGE$.AM1 | IC25.4 IC25.11 | IC9.7 41.91,6.99 59.69,6.99 | 59.69,6.99 72.39,6.99 74.93,8.89 IC11.7 | 59.69,6.99 IC10.7 | IC15.7 166.37,6.35 149.86,6.35 | 149.86,6.35 146.05,6.35 v144.78,7.62 | 149.86,6.35 IC14.7 | v17.78,6.35 16.51,7.62 16.51,26.67 15.88,26.67 | NB1.1 120.65,81.92 121.29,81.28 C20.- | C17.- 114.3,128.27 57.15,128.27 | IC16.7 168.91,39.37 171.45,36.83 185.42,36.83 185.42,34.29 193.04,34.29 193.04,35.56 IC28.4 196.85,35.56 C12.2 201.93,30.48 201.93,48.26 C16.- | IC7.14 46.36,49.53 v45.09,48.26 | IC7.11 51.44,41.91 52.71,40.64 55.88,40.64 57.15,41.91 IC8.5
  Bottom 0.635: v16.6,104.14 IC1.10 28.58,104.14 | EDGE$.BC2 20.32,80.34 20.32,68.58 v24.13,68.58 | 45.72,74.93 IC3.10 | 62.23,62.23 V4.1 62.23,46.99 | 45.72,74.93 V3.1 41.91,69.22 41.91,57.78 46.36,57.78 46.36,49.53 v45.09,48.26 45.09,36.83 44.45,36.83 | A12.1 A11.1 A10.1 A9.1 A8.1 58.42,101.6 | A4.1 A7.1 A6.1 A5.1 A3.1 107.95,104.14 v107.95,113.03 118.11,113.03 | 58.42,101.6 IC5.11 IC5.12 71.12,97.79 | 71.12,97.79 71.12,95.25 77.47,90.17 77.47,82.55 IC20.3 | Q1.1 38.74,36.83 IC7.8 44.45,36.83 | IC3.19 58.42,95.25 58.42,101.6 | C18.- C15.- 40.64,97.79 IC3.1 45.72,97.79 45.72,74.93 | 62.23,62.23 IC6.8 | 62.23,86.36 62.23,62.23 | 62.23,86.36 V5.1 | 62.23,86.36 62.23,97.79 71.12,97.79 | IC1.1 28.58,127 28.58,104.14 | V7.1 30.48,58.42 v30.48,70.48 | 26.67,6.35 v17.78,6.35 | 26.67,6.35 41.91,6.35 IC9.7 44.45,8.89 44.45,33.02 | 26.67,6.35 IC2.10 30.48,8.89 30.48,29.21 | 30.48,29.21 IC2.19 | 30.48,29.21 30.48,31.75 IC2.1 25.4,31.75 R35.1 | C6.2 C17.- | C6.2 118.11,113.03 | 44.45,36.83 44.45,33.02 | IC10.7 62.23,8.89 62.23,34.29 | 62.23,34.29 IC8.8 | 62.23,46.99 62.23,41.91 | 62.23,41.91 62.23,34.29 | 82.55,49.53 82.55,39.37 86.36,35.56 86.36,8.89 IC11.7 83.82,6.99 109.22,6.99 109.22,8.89 | 82.55,49.53 IC20.16 | IC19.12 116.84,48.26 116.84,62.23 C11.- NP.1 TSB.1 NB2.1 NB1.1 EPS.1 116.21,87.63 116.21,98.42 C5.2 118.11,113.03 | 109.22,8.89 109.22,20.32 | 109.22,20.32 109.22,21.59 IC12.2 IC12.1 | 109.22,8.89 IC12.7 111.76,6.99 129.54,6.99 | 129.54,6.99 143.51,6.99 v144.78,7.62 | 129.54,6.99 IC13.7 132.08,8.89 132.08,33.02 129.54,35.56 IC18.7 132.08,40.64 132.08,62.23 | 132.08,62.23 IC21.7 | 132.08,81.28 132.08,62.23 | 132.08,81.28 C20.-
  Bottom 0.635: 132.08,81.28 132.08,85.09 IC26.7 127.64,85.09 127.64,102.87 135.89,102.87 IC27.8 140.97,107.31 140.97,128.27 | 140.97,128.27 118.11,128.27 C6.2 | 140.97,128.27 149.86,128.27 FR1.2 FR0.2 154.94,124.46 | 154.94,124.46 154.94,106.68 FR3.2 FR2.2 149.86,104.14 146.05,102.23 146.05,95.25 IC25.3 IC25.4 151.13,92.71 151.13,85.09 | 151.13,85.09 IC25.7 | 151.77,62.23 151.77,78.74 151.13,79.38 C10.- 151.13,85.09 | 151.77,62.23 IC22.7 | 151.77,39.37 IC17.7 | 151.77,62.23 151.77,39.37 | 151.77,39.37 151.77,8.89 IC14.7 | 184.15,119.38 D6.C 184.15,123.19 Q6.3 Q4.1 154.94,124.46 | 184.15,119.38 184.15,116.84 177.8,116.84 176.53,115.57 176.53,111.76 177.8,110.49 C8.+ 168.91,107.95 168.91,97.79 IC24.13 IC24.12 168.91,95.25 168.91,85.09 | 168.91,85.09 168.91,62.23 | 168.91,62.23 IC23.7 | IC16.7 168.91,39.37 | 168.91,62.23 168.91,39.37 | IC15.7 168.91,8.89 C9.- 168.91,39.37 | 187.96,81.28 C3.2 C4.2 187.96,68.58 185.42,64.77 185.42,58.42 SV1.25 SV1.24 | 187.96,81.28 C1.2 | 198.12,81.28 SV1.16 187.96,81.28 | 198.12,81.28 200.66,81.28 200.66,60.96 202.57,58.42 202.57,48.26 C16.- | 198.12,81.28 198.12,119.38 SV1.1 184.15,119.38 | C2.2 162.56,85.09 IC24.7 168.91,85.09 | C13.- C19.2 109.22,20.32 | 28.58,104.14 28.58,101.6 30.48,99.06 30.48,71.12 | IC25.10 IC25.11 C14.2 | 82.55,49.53 82.55,80.01 IC20.4 | 44.45,33.02 R12.1 | 62.23,41.91 IC8.5 | 62.23,46.99 IC8.3
ICSR  (via drill 0.81)
  Top 0.406: IC22.3 146.69,72.39 146.69,69.85 142.24,69.85 139.07,66.04 128.27,66.04 v125.73,64.77
  Bottom 0.406: 120.65,8.89 120.02,8.89 | 120.65,8.89 124.46,8.89 124.46,20.32 125.73,20.32 | 125.73,20.32 127,20.32 128.27,19.05 | 128.27,19.05 128.91,19.05 | 125.73,20.32 v125.73,64.77 | IC12.8 120.65,8.89 | 128.27,19.05 IC13.3
IRQ  (via drill 0.81)
  Top 0.406: v164.47,33.66 146.05,33.66 143.51,32.38 115.57,32.38 112.4,31.11 88.9,31.11 87,29.84 79.38,29.84 78.11,28.57 55.88,28.57 v54.61,27.94
  Bottom 0.406: IC9.10 IC9.9 53.34,11.43 54.61,12.7 v54.61,27.94 | v164.47,33.66 164.47,40.64 165.74,41.91 IC16.6
MDIN
  Top 0.406: IC16.11 176.53,46.99 176.53,43.18 165.1,43.18 161.93,40.64 143.51,40.64 140.97,49.53 132.72,49.53 131.45,50.8 IC18.3
MDOUT  (via drill 0.81)
  Top 0.406: IC18.11 133.35,48.26 132.08,46.99 124.46,46.99 v124.46,45.72 | IC12.12 124.46,19.05 v124.46,24.13
  Bottom 0.406: v124.46,24.13 v124.46,45.72
MYIOR  (via drill 0.81)
  Top 0.406: v102.87,26.67 101.6,27.3 90.81,27.3 88.9,26.04 81.28,26.04 79.38,21.59 v74.93,21.59
  Top 0.635: IC10.2 IC10.13
  Bottom 0.406: IC10.13 v74.93,21.59 | v102.87,26.67 109.22,35.56 109.22,58.42 110.49,58.42 | 110.49,58.42 111.13,58.42 | 110.49,58.42 IC19.1
N$1
  Bottom 0.406: C2.1 IC23.2
N$2
  Bottom 0.406: IC27.14 152.4,120.02 FR0.1
N$3
  Bottom 0.406: H1.2 Q1.3
N$4
  Bottom 0.406: IC27.13 149.23,117.47 FR1.1
N$5
  Bottom 0.406: IC27.12 149.23,114.94 FR2.1
N$6
  Bottom 0.406: IC27.11 152.4,112.39 FR3.1
N$7
  Top 0.406: IC11.3 72.39,19.05 69.85,22.86 46.99,22.86 44.45,21.59 IC9.2
N$9
  Bottom 0.406: IC27.7 134.62,109.86 R9.1 K1.1 125.73,106.68 C5.1
N$10
  Bottom 0.406: IC27.6 134.62,112.39 R9.2 134.62,119.38 K1.2 125.73,119.38 C6.1
N$11
  Bottom 0.406: CL4.1 CL3.2 190.5,5.08 186.69,8.89 | 186.69,13.97 Q2.3 | 186.69,12.7 186.69,13.97 | 186.69,8.89 186.69,12.7 | 186.69,12.7 Q3.D | 186.69,13.97 Q3.G | D2.A 186.69,8.89
N$12
  Bottom 0.406: 92.71,8.89 92.08,8.89 | 92.71,8.89 R33.1 | IC11.8 92.71,8.89
N$13
  Bottom 0.406: IC29.6 199.39,27.94 R7.2
N$15
  Bottom 0.406: R7.1 199.39,22.86 IC29.4 195.58,16.51 Q2.2 184.15,16.51 Q3.S
N$16
  Bottom 0.406: IC29.1 187.33,27.94 R8.2
N$19
  Bottom 0.406: C4.1 179.07,72.39 176.53,71.12 176.53,64.77 IC23.9
N$20
  Bottom 0.635: D5.C 181.61,111.76 | 181.61,111.76 181.61,114.3 C7.- | 181.61,111.76 D6.A
N$22
  Bottom 0.635: Q6.1 172.72,118.11 C7.+ Q5.1
N$23  (via drill 0.81)
  Top 0.406: R33.2 106.68,6.99 76.2,6.99 74.3,5.71 39.37,5.71 v39.37,7.62
  Bottom 0.406: R33.2 C19.1 | v39.37,7.62 39.37,16.51 IC9.4
N$25
  Bottom 0.406: C3.1 176.53,72.39 IC23.12
N$26
  Bottom 0.635: Q6.2 170.18,120.65 Q4.3 160.02,118.11 | 160.02,118.11 R11.2 | 160.02,118.11 160.02,111.76 Q5.2
N$27
  Bottom 0.406: R2.1 D3.A 179.07,93.98 R1.1
N$28
  Top 0.406: IC28.2 180.34,38.1 CL2.1
  Bottom 0.406: CL2.1 R5.1 D1.A CL1.1
N$29
  Bottom 0.406: R4.1 189.87,108.58 186.69,105.41 Q7.2 184.15,101.6 181.61,104.14 ZD4.C
N$30  (via drill 0.81)
  Top 0.406: v194.31,53.34 191.77,54.61 176.53,54.61 176.53,55.88 166.37,55.88 IC16.1
  Bottom 0.406: IC28.5 C12.1 R6.2 194.31,44.45 v194.31,53.34
N$31
  Bottom 0.406: Q7.1 184.15,106.68 187.33,109.86 R3.1
N$32
  Bottom 0.406: IC25.6 IC25.5
N$135  (via drill 0.81)
  Top 0.406: v128.27,80.01 128.91,79.38 v142.24,79.38
NB1
  Top 0.406: IC20.38 98.43,82.55 99.06,81.92 NB1.2
NB2
  Top 0.406: IC20.37 98.43,80.01 99.06,79.38 NB2.2
NOIAKI  (via drill 0.81)
  Top 0.406: v55.88,56.52 41.91,56.52 IC7.1 | IC26.12 134.62,95.25 132.08,100.33 IC26.1 | IC11.6 70.49,11.43 70.49,13.97 IC10.10
  Bottom 0.406: IC6.1 55.88,80.01 v55.88,56.52 55.88,31.75 57.15,30.48 57.15,13.97 55.88,11.43 55.88,5.08 64.77,5.08 64.77,13.97 IC10.10 | IC11.6 81.92,11.43 81.92,5.71 146.69,5.71 146.69,16.51 147.32,16.51 | 147.32,16.51 149.23,16.51 | 147.32,16.51 144.78,16.51 144.78,34.29 143.51,35.56 143.51,57.15 144.78,58.42 144.78,66.04 144.15,67.31 144.15,73.66 143.51,74.93 143.51,97.79 140.34,97.79 138.43,95.25 IC26.12 | 147.32,16.51 IC14.4
NP
  Top 0.406: IC20.35 98.43,74.93 99.06,74.3 NP.2
PUMP
  Top 0.406: Q4.2 161.29,127 142.24,127 142.24,122.56 IC27.2
RB0  (via drill 0.81)
  Top 0.406: IC7.10 56.52,39.37 57.79,40.64 74.93,40.64 v75.57,41.27
  Bottom 0.406: v75.57,41.27 75.57,49.53 77.47,52.07 77.47,59.69 IC20.12
RB1  (via drill 0.81)
  Top 0.406: IC20.11 71.76,62.23 70.49,60.33 59.06,60.33 57.15,58.42 v54.61,58.42 | IC7.13 52.07,46.99 v54.61,50.8
  Bottom 0.406: v54.61,50.8 v54.61,58.42
RB2  (via drill 0.81)
  Top 0.406: IC6.3 62.87,74.93 64.77,76.2 70.49,76.2 71.12,76.83 73.66,76.83 74.3,75.56 v76.2,75.56
  Bottom 0.406: v76.2,75.56 76.2,66.04 77.47,64.77 IC20.10
RB3
  Top 0.406: IC6.6 62.87,67.31 64.77,66.04 69.85,66.04 73.03,68.58 76.2,68.58 78.11,67.31 IC20.9
RB4
  Top 0.406: IC20.8 82.55,69.85 82.55,66.04 72.39,66.04 69.85,64.77 IC6.10
RB5
  Top 0.406: IC6.13 69.85,72.39 70.49,71.75 76.84,71.75 78.11,72.39 IC20.7
RB6  (via drill 0.81)
  Top 0.406: IC20.6 82.55,74.93 82.55,71.12 78.74,71.12 76.2,69.85 72.39,69.85 71.12,68.58 58.42,68.58 54.61,63.5 v38.1,63.5
  Bottom 0.406: IC7.6 40.64,41.91 38.1,45.09 v38.1,63.5
RB7  (via drill 0.81)
  Top 0.406: IC20.5 78.11,77.47 78.11,74.3 76.2,73.03 70.49,73.03 69.85,73.66 55.88,73.66 55.25,73.03 49.53,73.03 46.99,71.75 41.91,71.75 v41.91,71.12
  Bottom 0.406: IC7.3 44.45,49.53 44.45,56.52 40.64,56.52 40.64,69.85 v41.91,71.12
RBS7
  Top 0.406: IC2.9 29.85,11.43 32.39,12.7 45.09,12.7 48.26,10.16 52.07,10.16 57.79,13.97 IC10.5
RDAL0  (via drill 0.81)
  Top 0.406: IC22.12 154.94,72.39 152.4,74.93 IC22.2 140.34,74.93 138.43,73.66 133.35,73.66 132.08,71.12 126.37,71.12 123.83,67.94 106.05,67.94 v104.14,66.04 90.17,66.04 82.55,78.74 56.52,78.74 52.71,76.2 47.63,76.2 45.72,77.47 IC3.9 | IC20.26 100.33,52.07 v104.14,53.34
  Bottom 0.406: v104.14,66.04 v104.14,53.34
RDAL1  (via drill 0.81)
  Top 0.406: v88.9,83.82 76.84,83.82 74.3,81.92 70.49,81.92 69.22,83.19 57.79,83.19 52.71,81.28 47.63,81.28 46.36,82.55 IC3.7 | IC19.7 100.97,43.18 99.06,45.09 v99.06,46.99
  Bottom 0.406: v88.9,83.82 88.9,58.42 92.71,54.61 IC20.27 97.79,54.61 99.06,53.34 v99.06,46.99
RDAL2  (via drill 0.81)
  Top 0.406: v90.17,81.28 75.57,81.28 74.3,80.64 69.85,80.64 68.58,81.92 58.42,81.92 52.71,77.47 IC3.12 | IC19.6 107.95,45.72 106.68,44.45 101.6,44.45 v100.33,45.72
  Bottom 0.406: v90.17,81.28 90.17,59.69 92.71,57.15 IC20.28 97.79,57.15 100.33,54.61 v100.33,45.72
RDAL3  (via drill 0.81)
  Top 0.406: IC5.14 v77.47,101.6 74.93,100.33 v67.31,100.33
  Bottom 0.406: IC3.14 53.34,82.55 53.34,92.08 59.69,92.08 59.69,100.33 v67.31,100.33 | v77.47,101.6 77.47,93.98 83.19,89.53 90.17,89.53 91.44,89.53 91.44,60.96 92.71,59.69 IC20.29
RDAL4  (via drill 0.81)
  Top 0.406: IC3.16 58.42,87.63 60.33,89.53 v93.35,89.53
  Bottom 0.406: IC5.22 77.47,121.92 77.47,105.41 78.74,102.87 78.74,95.25 85.09,90.81 92.08,90.81 v93.35,89.53 92.71,88.9 92.71,86.36 92.71,62.23 IC20.30
RDAL5  (via drill 0.81)
  Top 0.406: IC3.18 53.34,92.71 53.98,93.34 67.31,93.34 68.58,93.98 93.98,93.98 96.52,96.52 v97.79,96.52
  Bottom 0.406: IC5.16 83.82,106.68 83.82,99.06 86.36,96.52 v97.79,96.52 100.33,93.98 100.33,64.77 IC20.31
RDAL6  (via drill 0.81)
  Top 0.406: IC3.5 44.45,87.63 48.26,83.82 52.71,83.82 53.98,84.45 69.22,84.45 70.49,83.19 74.3,83.19 78.74,86.36 83.82,86.36 85.09,85.09 90.17,85.09 92.71,82.55 92.71,67.31 IC20.32 100.33,67.31 102.87,69.85 v123.19,69.85 | IC13.2 132.08,21.59 133.35,19.05 IC13.12
  Bottom 0.406: IC5.18 82.55,111.76 82.55,97.79 86.36,95.25 95.25,95.25 99.06,91.44 99.06,67.31 IC20.32 | v123.19,69.85 127,69.85 127,22.86 128.27,21.59 IC13.2
RDAL7  (via drill 0.81)
  Top 0.406: IC3.3 46.99,92.71 48.26,91.44 53.34,91.44 53.98,92.08 67.95,92.08 69.22,92.71 95.89,92.71 v96.52,92.08
  Bottom 0.406: IC5.20 81.28,116.84 81.28,97.16 86.36,93.98 94.62,93.98 v96.52,92.08 97.79,90.17 97.79,69.85 IC20.33
RDAL8
  Top 0.406: IC1.9 29.21,106.68 31.75,105.41 49.53,105.41 54.61,100.33 64.77,100.33 68.58,104.14 IC5.10
RDAL9
  Top 0.406: IC1.12 36.83,106.68 38.1,107.95 49.53,107.95 55.88,101.6 58.42,101.6 62.23,105.41 67.31,105.41 68.58,109.22 IC5.8
RDAL10
  Top 0.406: IC1.14 50.17,111.76 52.71,114.3 55.88,114.3 58.42,111.76 59.69,111.76 60.96,113.03 67.31,113.03 68.58,114.3 IC5.6
RDAL11
  Top 0.406: IC1.16 49.53,116.84 52.07,119.38 55.25,119.38 57.79,116.84 60.96,116.84 62.23,118.11 67.31,118.11 68.58,119.38 IC5.4
RDAL12
  Top 0.406: IC1.18 49.53,121.92 51.44,123.83 55.88,123.83 57.79,121.92 60.33,121.92 61.6,123.19 67.31,123.19 68.58,124.46 IC5.2
RDCOK  (via drill 0.81)
  Top 0.406: IC1.7 29.21,111.76 30.48,110.49 36.83,110.49 38.1,109.22 55.25,109.22 57.79,106.68 59.06,106.68 62.23,110.49 74.93,110.49 77.47,105.41 88.9,105.41 v88.9,101.6 104.14,101.6 107.32,104.78 139.7,104.78 140.97,106.68 140.97,114.94 IC27.5
  Bottom 0.406: 95.25,38.1 95.25,34.29 101.6,34.29 101.6,43.18 102.87,44.45 102.87,49.53 101.6,50.8 101.6,60.96 102.87,63.5 102.87,99.06 91.44,99.06 v88.9,101.6 | 95.25,38.1 95.25,38.73 | 95.25,38.1 IC20.21
RDIN  (via drill 0.81)
  Top 0.406: IC17.3 151.13,49.53 153.67,46.99 IC17.11 | v156.85,31.75 154.31,32.38 147.32,32.38 145.42,31.11 133.99,31.11 132.08,28.57 89.54,28.57 87.63,27.3 80.65,27.3 79.38,26.04 62.87,26.04 61.6,24.13 IC10.1 54.61,24.13 52.71,26.04 41.91,26.04 v40.64,26.67
  Bottom 0.406: IC17.11 158.75,46.99 158.75,34.29 v156.85,31.75 | v40.64,26.67 39.37,25.4 39.37,17.78 36.83,15.24 36.83,11.43 IC2.12
RDOUT
  Top 0.406: IC10.12 64.77,19.05 63.5,17.78 55.88,17.78 52.07,15.24 32.39,15.24 30.48,16.51 IC2.7
RDR+
  Bottom 0.406: D3.C 187.33,92.71 187.33,98.42 189.23,100.33 Q7.3 191.77,106.68 SV1.6
RDR-
  Bottom 0.406: SV1.9 189.23,99.06 R1.2
RIAKI  (via drill 0.81)
  Top 0.406: IC2.18 36.83,26.67 38.74,25.4 | 38.74,25.4 40.64,24.13 IC9.1 | v177.8,34.29 175.9,35.56 146.69,35.56 142.88,33.66 113.67,33.66 111.13,32.38 88.27,32.38 86.36,31.11 78.74,31.11 77.47,29.84 54.61,29.84 53.34,28.57 45.72,28.57 44.45,29.84 40.01,29.84 38.74,28.57 38.74,25.4 | IC18.1 133.35,55.88 134.62,54.61 146.05,54.61 147.32,55.88 158.75,55.88 165.1,48.26 168.28,48.26 171.45,44.45 IC16.10
  Bottom 0.406: IC16.10 175.26,44.45 177.8,41.91 v177.8,34.29
RIE  (via drill 0.81)
  Top 0.406: IC13.5 133.99,13.97 135.26,12.7 139.7,12.7 140.97,15.24 151.13,15.24 154.94,11.43 IC14.9 | v125.73,19.05 125.1,17.78 116.84,17.78 114.3,22.86 109.22,22.86 107.32,21.59 99.06,21.59 98.43,20.95 95.89,20.95 94.62,21.59 IC11.13 88.9,21.59 87,20.32 74.93,20.32 73.66,20.32 73.66,22.86 v74.93,24.13
  Bottom 0.406: IC8.11 71.12,39.37 71.12,25.4 74.93,25.4 v74.93,24.13 | IC13.5 125.73,13.97 v125.73,19.05
RINIT  (via drill 0.81)
  Top 0.406: IC2.5 23.5,24.77 23.5,33.02 24.77,34.92 24.77,43.81 20.32,47.62 20.32,82.55 19.05,84.45 19.05,95.89 24.13,95.89 24.13,99.06 32.39,99.06 34.29,100.97 51.44,100.97 54.61,98.42 67.95,98.42 69.85,96.52 89.54,96.52 93.35,100.33 114.3,100.33 118.11,97.79 v118.11,96.52
  Bottom 0.406: IC2.6 IC2.5 | v118.11,96.52 125.1,96.52 125.1,93.98 121.92,90.17 121.92,78.74 125.73,72.39 128.27,72.39 | 128.27,72.39 128.91,72.39 | 128.27,72.39 IC21.3
RIRQ
  Top 0.406: IC18.2 132.08,53.34 133.35,52.07 142.24,52.07 144.78,41.91 IC17.6
RRDY
  Top 0.406: IC14.10 IC15.5
RRDYI
  Top 0.406: IC14.11 158.75,16.51 161.29,15.24 168.91,15.24 | 168.91,15.24 168.91,10.16 153.67,10.16 151.13,12.7 144.78,12.7 140.97,9.53 140.97,6.99 109.22,6.99 109.22,12.06 106.68,15.24 97.16,15.24 93.98,16.51 IC11.11 | IC15.3 167.64,19.05 168.91,17.78 168.91,15.24
RSYNC
  Bottom 0.406: IC2.16 IC2.17
RTS
  Top 0.406: SV1.8 190.5,101.6 186.06,97.16 184.15,97.16 181.61,94.61 177.8,94.61 176.53,92.71 IC24.11
  Bottom 0.406: SV1.8 SV1.7
RX+
  Bottom 0.406: CL1.2 R22.2 190.5,66.04 SV1.22
RX-
  Bottom 0.635: SV1.20 196.85,71.12 196.85,58.42 195.58,55.88 D1.C R5.2 190.5,50.8 190.5,48.26 191.77,46.99 191.77,40.64 IC28.1
RXCL
  Top 0.406: IC16.3 168.91,49.53 170.82,48.26 177.17,48.26 179.71,50.8 193.04,50.8 195.58,52.07 195.58,68.58 SV1.21
RXD  (via drill 0.81)
  Top 0.406: v143.51,59.69 189.23,59.69 191.77,63.5 SV1.23 | v76.2,60.96 107.32,60.96 107.32,65.41 123.83,65.41 127.64,68.58 132.72,68.58 134.62,72.39 IC21.12
  Bottom 0.406: v143.51,59.69 140.97,59.69 140.97,72.39 IC21.12 | v76.2,60.96 76.2,54.61 73.66,50.8 73.66,39.37 IC20.20
RXEIA
  Top 0.406: IC23.3 168.91,72.39 168.91,80.01 187.96,80.01 189.23,81.92 189.23,85.09 190.5,86.36 190.5,88.9 SV1.13
SBRK  (via drill 0.81)
  Top 0.406: IC8.6 63.5,39.37 64.77,38.1 71.12,38.1 71.76,37.47 81.28,37.47 83.19,39.37 v91.44,39.37 | IC22.9 152.4,64.77 151.13,63.5 145.42,63.5 140.97,60.33 128.27,60.33 | 128.27,60.33 127.64,60.33 | 128.27,60.33 109.22,60.33 107.95,59.69 99.7,59.69 97.79,58.42 91.44,58.42 v88.9,55.88
  Bottom 0.406: v88.9,55.88 90.17,54.61 90.17,40.64 v91.44,39.37
START  (via drill 0.81)
  Top 0.406: IC25.12 158.75,95.25 158.75,92.71 158.75,91.44 144.78,91.44 142.24,90.17 139.7,91.44 125.73,91.44 v124.46,90.17
  Bottom 0.406: v124.46,90.17 124.46,83.82 127,82.55 127,74.93 IC21.2
TDAL0  (via drill 0.81)
  Top 0.406: IC8.7 IC7.9 47.63,36.83 45.09,38.1 40.01,38.1 38.74,36.83 34.93,36.83 34.29,38.1 34.29,40.64 33.02,41.91 v33.02,46.99
  Bottom 0.406: IC4.11 34.29,69.22 33.02,66.67 v33.02,46.99
TDAL1  (via drill 0.81)
  Top 0.406: v34.29,59.69 35.56,58.42 v52.07,58.42
  Bottom 0.406: IC4.13 36.83,80.01 36.83,68.58 34.29,64.77 v34.29,59.69 | v52.07,58.42 53.34,57.15 53.34,53.34 52.07,52.07 52.07,45.72 50.8,44.45 IC7.12 48.26,44.45 47.63,43.18 47.63,34.92 R12.2
TDAL2
  Top 0.406: IC4.8 21.59,80.01 21.59,65.41 40.01,65.41 40.64,64.77 46.99,64.77 51.44,71.75 55.88,71.75 56.52,72.39 IC6.4
TDAL3  (via drill 0.81)
  Top 0.406: IC6.7 57.79,64.77 55.88,62.23 40.01,62.23 39.37,61.59 36.83,61.59 34.93,63.5 v24.77,63.5
  Bottom 0.406: v24.77,63.5 25.4,64.77 25.4,69.85 21.59,69.85 21.59,82.55 24.13,85.09 IC4.6
TDAL4  (via drill 0.81)
  Top 0.406: IC6.9 64.77,62.23 62.87,63.5 58.42,63.5 56.52,60.33 36.2,60.33 35.56,60.96 29.21,60.96 v28.58,59.69
  Bottom 0.406: IC4.4 29.21,90.17 29.21,60.96 v28.58,59.69
TDAL5  (via drill 0.81)
  Top 0.406: IC4.2 29.21,95.25 31.12,93.98 52.71,93.98 53.98,95.25 v66.04,95.25
  Bottom 0.406: v66.04,95.25 66.04,93.98 73.66,87.63 73.66,69.85 IC6.12
TDAL6
  Top 0.406: IC7.7 45.09,39.37 46.99,38.1 62.87,38.1 65.41,34.29 IC8.9
  Bottom 0.406: IC4.15 38.1,85.09 38.1,68.58 35.56,64.77 35.56,62.23 36.83,60.96 36.83,43.81 40.64,39.37 IC7.7
TDAL7
  Top 0.406: IC8.12 64.77,41.91 62.23,43.18 56.52,43.18 55.25,41.91 53.34,41.91 52.07,43.18 47.63,43.18 45.09,46.99 IC7.4
  Bottom 0.406: IC7.4 40.64,46.99 39.37,48.26 39.37,90.17 IC4.17
TDAL15  (via drill 0.81)
  Top 0.406: IC8.4 55.25,44.45 v54.61,43.81
  Bottom 0.406: IC9.13 52.07,21.59 52.07,25.4 50.8,26.67 50.8,31.75 54.61,34.29 v54.61,43.81
TSB
  Top 0.406: IC20.36 98.43,77.47 99.06,76.83 TSB.2
TX+
  Bottom 0.406: CL4.2 201.93,12.7 201.93,46.35 196.22,46.35 196.22,49.53 200.66,52.07 200.66,57.15 199.39,59.69 199.39,76.2 SV1.18
  Bottom 0.635: SV1.18 190.5,76.2 R24.2
TX-
  Bottom 0.406: SV1.19 198.12,73.66 198.12,57.78 196.22,54.61 191.77,54.61 191.77,49.53 193.04,48.26 193.04,25.4 IC29.5 200.66,25.4 200.66,13.97 Q2.1 D2.C
TXD  (via drill 0.81)
  Top 0.406: v177.8,86.36 171.45,86.36 169.55,88.27 169.55,89.53 168.91,90.17 IC24.5 164.47,90.17 164.47,83.82 160.02,83.82 159.39,83.19 146.69,83.19 145.42,85.09 IC26.8 | v179.07,35.56 179.07,33.02 185.42,25.4 IC29.2
  Bottom 0.406: v177.8,86.36 177.8,78.74 184.15,78.74 184.15,69.85 177.8,69.85 177.8,45.72 179.07,44.45 v179.07,35.56 | IC24.5 IC24.4
V3
  Top 0.406: IC6.5 57.15,69.85 55.25,69.22 V3.2
  Bottom 0.406: R16.2 V3.2
V4
  Bottom 0.406: IC6.11 71.12,67.31 R17.2 71.12,56.52 V4.2
V5
  Bottom 0.406: V5.2 67.95,82.55 72.39,82.55 R18.2 IC6.14
V6
  Top 0.406: IC7.5 39.37,44.45 38.1,46.99 V6.2
  Bottom 0.406: V6.2 R14.2
V7
  Top 0.406: R15.2 IC7.2
  Bottom 0.406: R15.2 V7.2
VCC  (via drill 0.81)
  Top 0.406: IC15.2 170.18,21.59 172.09,19.05 IC15.12
  Top 0.635: EDGE$.BV1 19.97,127.88 21.38,129.12 29.51,129.12 31.45,127 IC1.20 | v64.77,58.42 R17.1 60.96,57.15 58.42,54.61 IC7.16 | IC4.20 38.1,97.79 40.64,99.69 50.8,99.69 IC3.20 | IC20.34 97.79,72.39 99.06,71.12 v111.76,71.12 | R18.1 73.66,85.09 77.47,87.63 IC20.1 v85.09,87.63 | IC2.20 36.83,31.75 38.74,31.11 46.99,31.11 v47.63,30.48 | IC11.14 95.25,24.13 95.89,24.77 98.43,24.77 99.7,23.5 106.05,23.5 109.22,26.04 119.38,26.04 | 119.38,26.04 137.16,26.04 IC13.14 146.05,24.13 147.96,26.04 157.48,26.04 | 119.38,26.04 IC12.14 | 157.48,26.04 173.99,26.04 IC15.14 184.15,24.13 R8.1 | 157.48,26.04 IC14.14 | IC26.14 IC25.1 | IC16.2 168.91,52.07 171.45,54.61 IC16.14 | v166.37,104.14 169.55,104.14 171.45,101.6 171.45,91.44 172.72,90.17 IC24.10 | IC13.4 130.81,15.24 134.62,15.24 135.89,13.97 IC13.10 | IC17.1 IC17.14 IC17.13 | IC22.10 154.94,67.31 149.86,69.85 IC22.4 | IC27.4 143.51,117.47 143.51,125.09 IC27.16
  Bottom 0.635: 64.77,80.01 IC6.16 | 48.26,97.79 IC3.20 | 48.26,66.67 48.26,97.79 | 48.26,66.67 R16.1 | 48.26,97.79 48.26,102.87 | 48.26,102.87 48.26,104.14 55.88,104.14 R26.1 R25.1 R23.1 R21.1 R19.1 55.88,128.27 86.36,128.27 | R32.1 R29.1 R28.1 R27.1 R31.1 102.87,128.27 97.79,128.27 | 86.36,128.27 97.79,128.27 | 86.36,128.27 IC5.24 | R18.1 69.85,88.9 64.77,88.9 64.77,80.01 | 64.77,80.01 v64.77,58.42 67.31,57.15 IC8.16 65.41,52.07 65.41,24.13 IC10.14 R41.2 | IC1.20 36.83,127 36.83,119.38 | 36.83,114.3 36.83,97.79 IC4.20 31.75,97.79 31.75,52.07 R15.1 R14.1 | 36.83,114.3 36.83,119.38 | 153.67,100.33 IC25.14 C14.1 162.56,100.33 v166.37,104.14 | IC25.1 153.67,100.33 | IC7.16 47.63,54.61 | 47.63,54.61 47.63,45.72 46.36,44.45 46.36,33.66 v47.63,30.48 47.63,24.13 | 48.26,66.67 47.63,66.67 47.63,54.61 | EDGE$.AA2 13.97,3.81 R34.1 47.63,3.81 47.63,24.13 | 47.63,24.13 IC9.14 | v85.09,87.63 85.09,40.64 88.9,36.83 88.9,24.13 IC11.14 | 114.3,48.26 IC19.5 | 114.3,53.34 114.3,62.23 C11.+ 113.67,71.12 | 114.3,53.34 114.3,48.26 | 113.67,71.12 v113.67,74.3 v113.67,76.83 v113.67,79.38 v113.67,81.92 v113.67,84.45 113.67,101.6 97.79,101.6 97.79,128.27 | 134.62,55.88 134.62,39.37 137.16,36.83 IC13.14 134.62,24.13 134.62,13.97 IC13.10 | 134.62,55.88 IC18.14 | 134.62,77.47 IC21.14 | 134.62,77.47 134.62,55.88 | 134.62,81.28 134.62,100.33 IC26.14 143.51,104.14 143.51,122.56 | 134.62,81.28 134.62,77.47 | 153.67,100.33 153.67,82.55 C10.+ IC22.14 154.31,77.47 154.31,67.31 | 154.31,54.61 IC17.14 | 154.31,67.31 154.31,54.61 | IC27.16 143.51,125.09 143.51,122.56 | R8.1 184.15,20.95 190.5,20.95 190.5,32.38 186.69,32.38 183.52,34.92 183.52,41.91 186.06,44.45 R6.1
  Bottom 0.635: 171.45,77.47 171.45,54.61 | 171.45,77.47 171.45,87.63 IC24.9 IC24.10 | 171.45,54.61 171.45,27.94 C9.+ IC15.14 172.09,24.13 172.09,19.05 | 171.45,54.61 IC16.14 IC16.13 | 171.45,77.47 IC23.14 | 114.3,48.26 114.3,38.1 110.49,31.75 110.49,26.67 106.68,22.86 101.6,22.86 C13.+ | 48.26,102.87 C15.+ | 113.67,71.12 v111.76,71.12 | 154.31,54.61 154.31,26.04 157.48,26.04 IC14.14 | 134.62,81.28 C20.+ | 36.83,114.3 IC1.15 | 36.83,119.38 IC1.17 | IC15.10 172.09,13.97 172.09,19.05 | 172.09,19.05 IC15.12 | 154.31,67.31 IC22.10 | 114.3,53.34 IC19.3 | 143.51,122.56 IC27.15
XCSR  (via drill 0.81)
  Top 0.406: IC22.11 158.75,69.85 160.02,68.58 v161.29,68.58 | IC13.11 132.08,16.51 131.45,17.78 127.64,17.78 127.64,12.7 116.84,12.7 115.57,11.43 IC12.6 | v142.24,58.42 v162.56,58.42
  Bottom 0.406: IC13.11 140.97,16.51 140.97,30.48 142.24,31.75 v142.24,58.42 | v162.56,58.42 162.56,67.31 v161.29,68.58
XDATA0  (via drill 0.81)
  Top 0.406: IC20.25 v105.41,49.53 | IC26.9 134.62,87.63 133.35,88.9 128.27,88.9 125.73,86.36 v104.14,86.36
  Bottom 0.406: v105.41,49.53 105.41,62.23 106.68,66.04 106.68,69.85 104.14,72.39 v104.14,86.36
XIE  (via drill 0.81)
  Top 0.406: v142.24,22.86 143.51,21.59 IC14.2 | v133.35,36.83 132.08,36.2 111.76,36.2 109.22,34.92 88.9,34.92 87,36.2 84.46,36.2 81.92,34.92 76.84,34.92 75.57,33.66 70.49,33.66 69.85,36.83 IC8.10
  Bottom 0.406: 139.7,11.43 138.43,11.43 | 139.7,11.43 142.24,11.43 v142.24,22.86 | 139.7,11.43 IC13.9 134.62,11.43 | 134.62,11.43 133.35,11.43 v133.35,36.83 133.35,92.71 IC26.4 | 134.62,11.43 136.53,11.43
XIRQ
  Top 0.406: IC16.9 171.45,41.91 170.18,40.64 165.1,40.64 163.83,39.37 IC17.8
XRDY
  Top 0.406: IC15.9 171.45,11.43 171.45,17.14 168.91,20.32 163.83,20.32 163.83,21.59 IC14.13
XRDY0  (via drill 0.81)
  Top 0.406: v105.41,40.64 99.06,40.64 97.16,41.91 IC20.22 93.35,40.64 77.47,40.64 77.47,44.45 IC8.13 | v106.68,88.27 124.46,88.27 126.37,90.17 IC26.5
  Bottom 0.406: v105.41,40.64 105.41,41.91 106.68,43.18 106.68,62.23 107.95,66.04 107.95,71.12 106.68,72.39 v106.68,88.27
XRDYI  (via drill 0.81)
  Top 0.406: IC14.1 152.4,24.13 v153.67,22.86 170.82,22.86 172.72,20.32 176.53,20.32 176.53,16.51 IC15.11 | IC26.6 132.08,87.63 133.35,86.36 133.35,83.19 143.51,83.19 146.69,79.38 150.5,79.38 v152.4,80.01
  Bottom 0.406: v153.67,22.86 153.04,23.5 153.04,80.01 v152.4,80.01